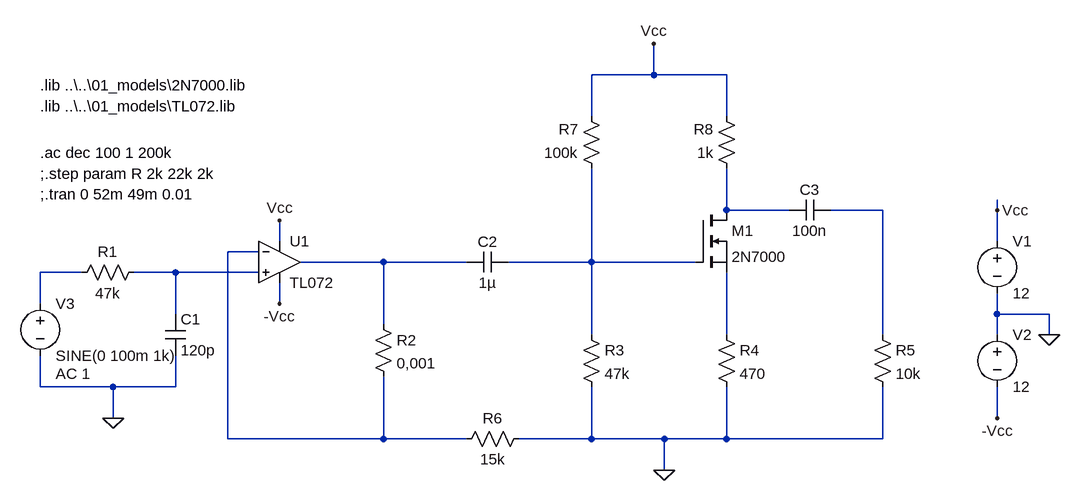
[diagram p0: schematic cs_amplifier_lab_values.asc]
cs_amplifier_lab_values.asc, the LTspice schematic file:
Version 4
SHEET 1 1932 884
WIRE 1104 16 1104 -32
WIRE 1104 16 1008 16
WIRE 1216 16 1104 16
WIRE 1008 80 1008 16
WIRE 1216 80 1216 16
WIRE 1216 224 1216 160
WIRE 1312 224 1216 224
WIRE 1456 224 1376 224
WIRE 1632 224 1632 208
WIRE 528 272 528 240
WIRE 1632 272 1632 224
WIRE 496 288 448 288
WIRE 688 304 560 304
WIRE 816 304 688 304
WIRE 1008 304 1008 160
WIRE 1008 304 880 304
WIRE 1168 304 1008 304
WIRE 224 320 160 320
WIRE 368 320 304 320
WIRE 496 320 368 320
WIRE 160 368 160 320
WIRE 528 368 528 336
WIRE 368 384 368 320
WIRE 1632 384 1632 352
WIRE 1712 384 1632 384
WIRE 688 400 688 304
WIRE 1008 416 1008 304
WIRE 1216 416 1216 320
WIRE 1456 416 1456 224
WIRE 1632 416 1632 384
WIRE 1712 416 1712 384
WIRE 160 496 160 448
WIRE 272 496 160 496
WIRE 368 496 368 448
WIRE 368 496 272 496
WIRE 272 544 272 496
WIRE 1632 544 1632 496
WIRE 448 576 448 288
WIRE 688 576 688 480
WIRE 688 576 448 576
WIRE 816 576 688 576
WIRE 1008 576 1008 496
WIRE 1008 576 896 576
WIRE 1120 576 1008 576
WIRE 1216 576 1216 496
WIRE 1216 576 1120 576
WIRE 1456 576 1456 496
WIRE 1456 576 1216 576
WIRE 1120 624 1120 576
FLAG 1712 416 0
FLAG 1632 224 Vcc
FLAG 1632 544 -Vcc
FLAG 272 544 0
FLAG 1120 624 0
FLAG 528 240 Vcc
FLAG 1104 -32 Vcc
FLAG 528 368 -Vcc
SYMBOL res 208 336 R270
WINDOW 0 32 56 VTop 2
WINDOW 3 0 56 VBottom 2
SYMATTR InstName R1
SYMATTR Value 47k
SYMBOL res 672 384 R0
SYMATTR InstName R2
SYMATTR Value 0,001
SYMBOL res 992 400 R0
SYMATTR InstName R3
SYMATTR Value 47k
SYMBOL res 1200 400 R0
SYMATTR InstName R4
SYMATTR Value 470
SYMBOL res 1440 400 R0
SYMATTR InstName R5
SYMATTR Value 10k
SYMBOL res 912 560 R90
WINDOW 0 0 56 VBottom 2
WINDOW 3 32 56 VTop 2
SYMATTR InstName R6
SYMATTR Value 15k
SYMBOL res 1024 176 R180
WINDOW 0 36 76 Left 2
WINDOW 3 36 40 Left 2
SYMATTR InstName R7
SYMATTR Value 100k
SYMBOL res 1232 176 R180
WINDOW 0 36 76 Left 2
WINDOW 3 36 40 Left 2
SYMATTR InstName R8
SYMATTR Value 1k
SYMBOL cap 352 384 R0
SYMATTR InstName C1
SYMATTR Value 120p
SYMBOL cap 880 288 R90
WINDOW 0 0 32 VBottom 2
WINDOW 3 32 32 VTop 2
SYMATTR InstName C2
SYMATTR Value 1µ
SYMBOL cap 1376 208 R90
WINDOW 0 0 32 VBottom 2
WINDOW 3 32 32 VTop 2
SYMATTR InstName C3
SYMATTR Value 100n
SYMBOL nmos 1168 224 R0
SYMATTR InstName M1
SYMATTR Value 2N7000
SYMBOL voltage 1632 256 R0
WINDOW 123 0 0 Left 2
WINDOW 39 0 0 Left 2
SYMATTR InstName V1
SYMATTR Value 12
SYMBOL voltage 1632 400 R0
WINDOW 123 0 0 Left 2
WINDOW 39 0 0 Left 2
SYMATTR InstName V2
SYMATTR Value 12
SYMBOL voltage 160 352 R0
WINDOW 123 24 124 Left 2
WINDOW 39 0 0 Left 2
SYMATTR Value2 AC 1
SYMATTR InstName V3
SYMATTR Value SINE(0 100m 1k)
SYMBOL Opamps\\opamp2 528 240 R0
SYMATTR InstName U1
SYMATTR Value TL072
TEXT 160 136 Left 2 !.ac dec 100 1 200k
TEXT 160 168 Left 2 !;.step param R 2k 22k 2k
TEXT 160 200 Left 2 !;.tran 0 52m 49m 0.01
TEXT 160 32 Left 2 !.lib ..\\..\\01_models\\2N7000.lib
TEXT 160 64 Left 2 !.lib ..\\..\\01_models\\TL072.lib

The netlist it stands for:
* cs_amplifier_lab_values.asc
R1 N006 N007 47k
R2 N004 N003 0,001
R3 N005 0 47k
R4 N008 0 470
R5 N002 0 10k
R6 0 N003 15k
R7 N005 Vcc 100k
R8 N001 Vcc 1k
C1 N007 0 120p
C2 N005 N004 1µ
C3 N002 N001 100n
M1 N001 N005 N008 N008 2N7000
V1 Vcc 0 12
V2 0 -Vcc 12
V3 N006 0 SINE(0 100m 1k) AC 1
XU1 N007 N003 Vcc -Vcc N004 TL072  ; pins In+ In- V+ V- OUT
.model NMOS NMOS
.model PMOS PMOS
.lib standard.mos
.ac dec 100 1 200k
;.step param R 2k 22k 2k
;.tran 0 52m 49m 0.01
.lib ..\..\01_models\2N7000.lib
.lib ..\..\01_models\TL072.lib
.backanno
.end